# Altium schematic sheet my-cnc.SchDoc
size B
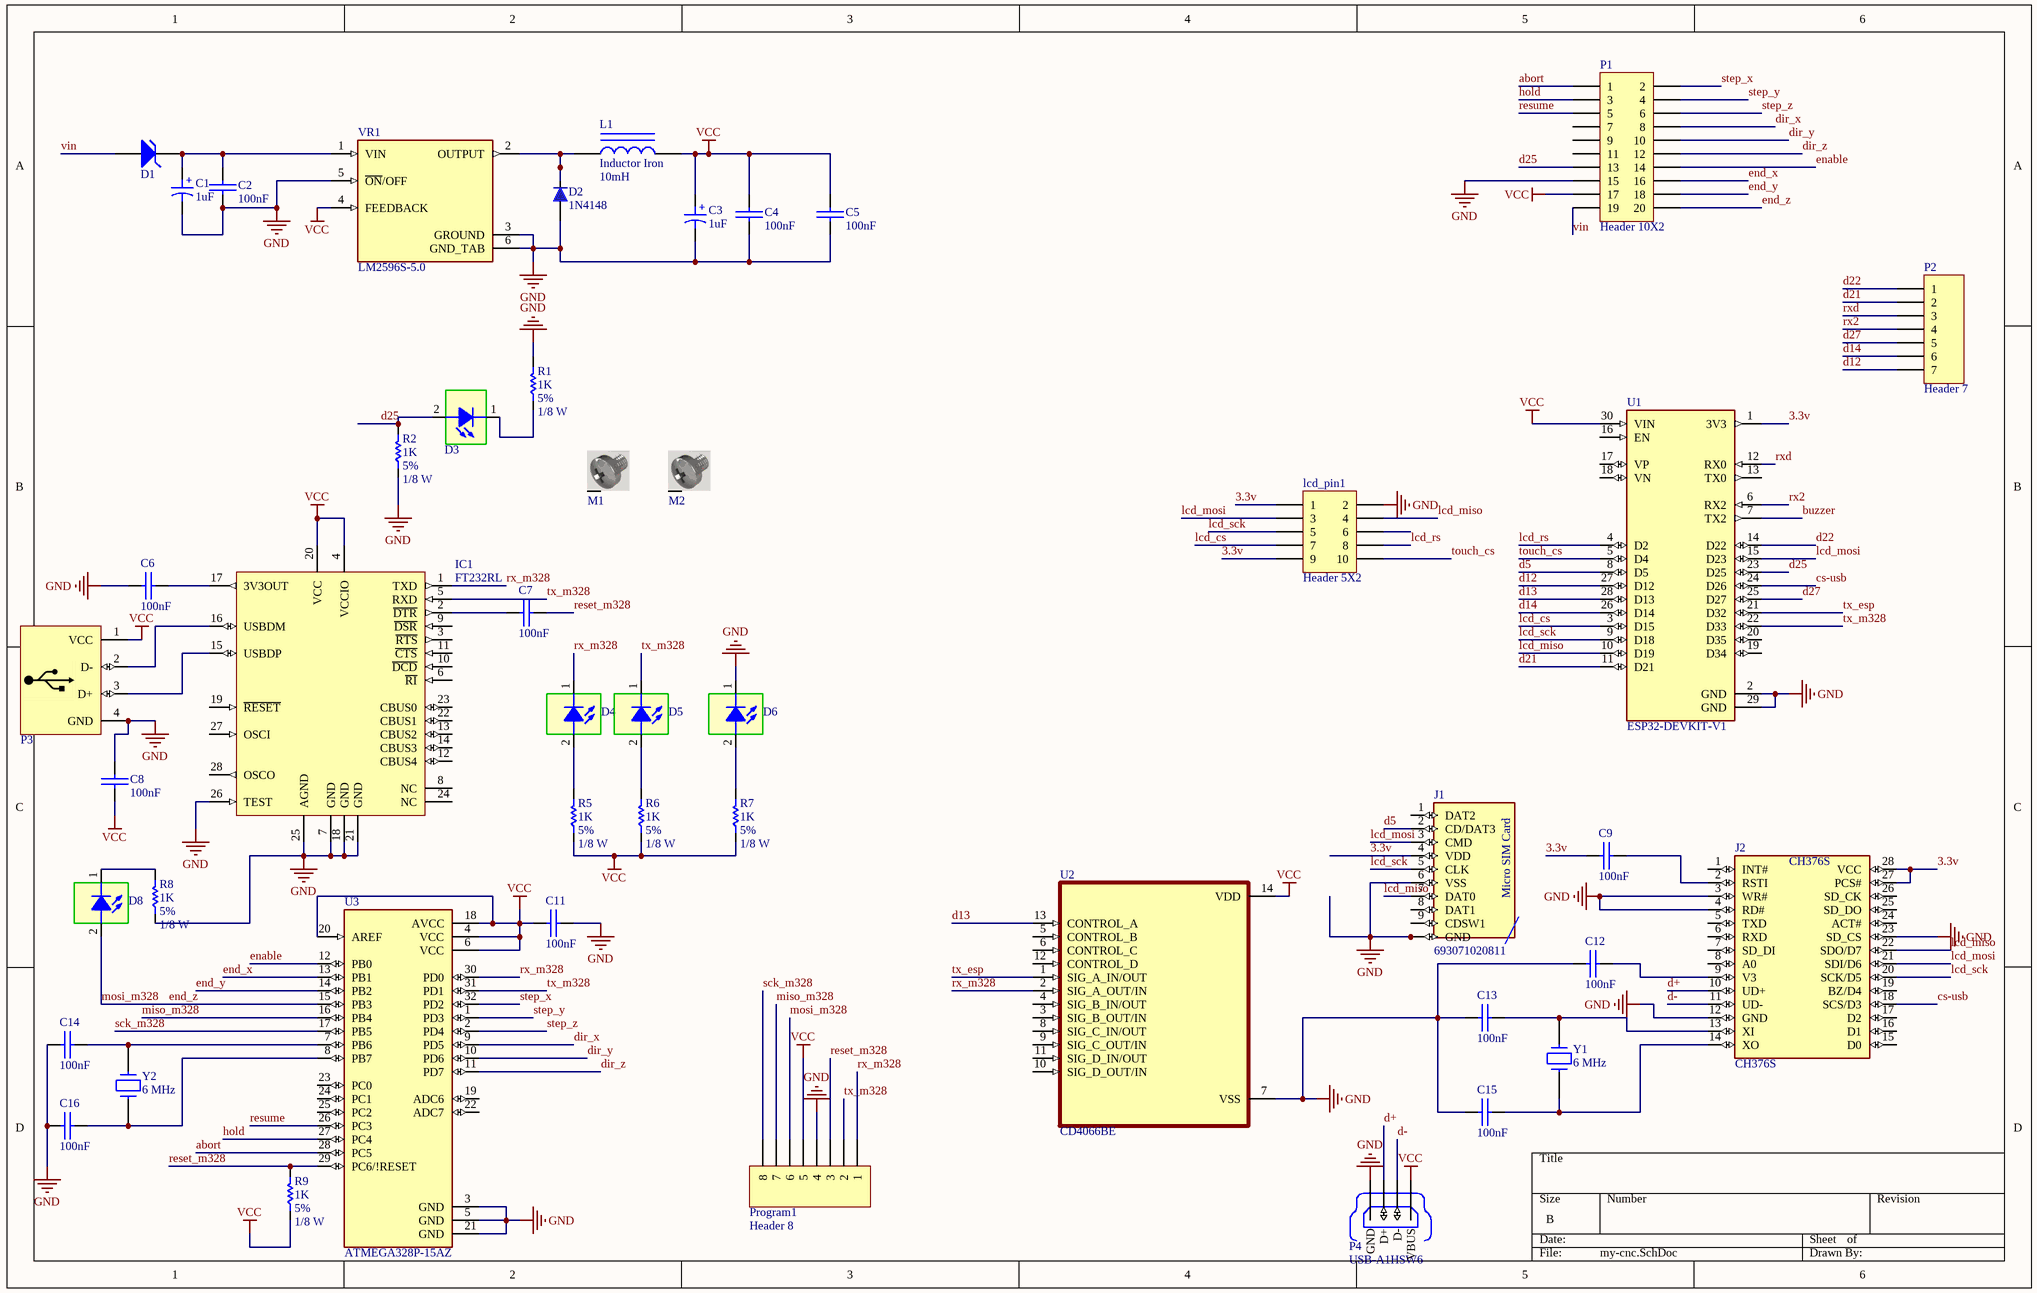
[diagram p0: my-cnc.SchDoc]

## Parts
C1  1uF  [CAP SMD 470uF]
C2  100nF  [SMD_CAP_1206]
C3  1uF  [CAP SMD 470uF]
C4  100nF  [SMD_CAP_1206]
C5  100nF  [SMD_CAP_1206]
C6  100nF  [SMD_CAP_1206]
C7  100nF  [SMD_CAP_1206]
C8  100nF  [SMD_CAP_1206]
C9  100nF  [SMD_CAP_1206]
C11  100nF  [SMD_CAP_1206]
C12  100nF  [SMD_CAP_1206]
C13  100nF  [SMD_CAP_1206]
C14  100nF  [SMD_CAP_1206]
C15  100nF  [SMD_CAP_1206]
C16  100nF  [SMD_CAP_1206]
D1  Diode Zener  [Diode 1W]  (value not drawn)
D2  1N4148  [Diode 1n4148 SMD]
D3  SMD 1206 LED  [LED 1206]  (value not drawn)
D4  SMD 1206 LED  [LED 1206]  (value not drawn)
D5  SMD 1206 LED  [LED 1206]  (value not drawn)
D6  SMD 1206 LED  [LED 1206]  (value not drawn)
D8  SMD 1206 LED  [LED 1206]  (value not drawn)
IC1  FT232RL  [SSOP-28_L]
J1  693071020811  [693071020811]
J2  CH376S  [SOP28]
L1  Inductor Iron  value 10mH  [AXIAL-0.9]
lcd_pin1  Header 5X2  [HDR2X5]
M1  Screw  [Board Screw]  (value not drawn)
M2  Screw  [Board Screw]  (value not drawn)
P1  Header 10X2  [HDR2X10]
P2  Header 7  [HDR1X7]
P3  USB Connector  [USB2.5-2H4F]  (value not drawn)
P4  USB-A1HSW6  [OST_USB-A1HSW6]
Program1  Header 8  [HDR1X8]
R1  Tolerance: 5%  Power: 1/8 W  [RES 1206 (3216X08L)]  (hidden comment: 1K)
R2  Tolerance: 5%  Power: 1/8 W  [RES 1206 (3216X08L)]  (hidden comment: 1K)
R5  Tolerance: 5%  Power: 1/8 W  [RES 1206 (3216X08L)]  (hidden comment: 1K)
R6  Tolerance: 5%  Power: 1/8 W  [RES 1206 (3216X08L)]  (hidden comment: 1K)
R7  Tolerance: 5%  Power: 1/8 W  [RES 1206 (3216X08L)]  (hidden comment: 1K)
R8  Tolerance: 5%  Power: 1/8 W  [RES 1206 (3216X08L)]  (hidden comment: 1K)
R9  Tolerance: 5%  Power: 1/8 W  [RES 1206 (3216X08L)]  (hidden comment: 1K)
U1  ESP32-DEVKIT-V1  [MODULE_ESP32_DEVKIT_V1]
U2  CD4066BE  [DIP794W45P254L1969H508Q14]
U3  ATMEGA328P-15AZ  [QFP80P900X900X120-32N]
VR1  LM2596S-5.0  [TO170P1524X483-6N]
Y1  6 MHz  [My_Crystal]
Y2  6 MHz  [My_Crystal]

## Nets
GND: C1.2 C2.1(+) C3.2 C4.1(+) C5.1(+) C6.2(-) C8.1(+) C11.2(-) C12.2(-) C13.2(-) C14.1(+) C15.2(-) C16.1(+) D2.1 D6.1 IC1.7(GND) IC1.18(GND) IC1.21(GND) IC1.25(AGND) IC1.26(TEST) J1.6(VSS) J1.10(GND) J1.11(GND) J1.12(GND) J1.13(GND) J2.3(WR#) J2.4(RD#) J2.12(GND) J2.23(SD_CS) lcd_pin1.2 P1.15 P3.4(GND) P4.4(GND) Program1.4 R1.2 R2.1 R8.1 U1.2(GND) U1.29(GND) U2.7(VSS) U3.3(GND) U3.5(GND) U3.21(GND) VR1.3(GROUND) VR1.5(~{ON}/OFF) VR1.6(GND_TAB)
VCC: C3.1 C4.2(-) C5.2(-) C8.2(-) C11.1(+) IC1.4(VCCIO) IC1.20(VCC) L1.2 P1.17 P3.1(VCC) P4.1(VBUS) Program1.5 R5.1 R6.1 R7.1 R9.1 U1.30(VIN) U2.14(VDD) U3.4(VCC) U3.6(VCC) U3.18(AVCC) U3.20(AREF) VR1.4(FEEDBACK)
3.3v: C9.2(-) J1.4(VDD) J2.27(PCS#) J2.28(VCC) lcd_pin1.1 lcd_pin1.9 U1.1(3V3)
abort: P1.1 U3.28(PC5)
buzzer: U1.7(TX2)
cs-usb: J2.18(SCS/D3) U1.24(D26)
d5: J1.2(CD/DAT3) U1.8(D5)
d12: P2.7 U1.27(D12)
d13: U1.28(D13) U2.13(CONTROL_A)
d14: P2.6 U1.26(D14)
d21: P2.2 U1.11(D21)
d22: P2.1 U1.14(D22)
d25: D3.2 P1.13 R2.2 U1.23(D25)
d27: P2.5 U1.25(D27)
d+: J2.10(UD+) P4.3(D+)
d-: J2.11(UD-) P4.2(D-)
dir_x: P1.8 U3.9(PD5)
dir_y: P1.10 U3.10(PD6)
dir_z: P1.12 U3.11(PD7)
enable: P1.14 U3.12(PB0)
end_x: P1.16 U3.13(PB1)
end_y: P1.18 U3.14(PB2)
end_z: D8.2 P1.20 Program1.6 U3.15(PB3)  [also labelled mosi_m328]
hold: P1.3 U3.27(PC4)
lcd_cs: lcd_pin1.7 U1.3(D15)
lcd_miso: J1.7(DAT0) J2.22(SDO/D7) lcd_pin1.4 U1.10(D19)
lcd_mosi: J1.3(CMD) J2.21(SDI/D6) lcd_pin1.3 U1.15(D23)
lcd_rs: lcd_pin1.8 U1.4(D2)
lcd_sck: J1.5(CLK) J2.20(SCK/D5) lcd_pin1.5 U1.9(D18)
miso_m328: Program1.7 U3.16(PB4)
reset_m328: C7.1(+) Program1.3 R9.2 U3.29(PC6/!RESET)
resume: P1.5 U3.26(PC3)
rx2: P2.4 U1.6(RX2)
rx_m328: D4.1 IC1.1(TXD) Program1.1 U2.2(SIG_A_OUT/IN) U3.30(PD0)
rxd: P2.3 U1.12(RX0)
sck_m328: Program1.8 U3.17(PB5)
step_x: P1.2 U3.32(PD2)
step_y: P1.4 U3.1(PD3)
step_z: P1.6 U3.2(PD4)
touch_cs: lcd_pin1.10 U1.5(D4)
tx_esp: U1.21(D32) U2.1(SIG_A_IN/OUT)
tx_m328: D5.1 IC1.5(RXD) Program1.2 U1.22(D33) U3.31(PD1)
vin: D1.1(A) P1.19
NetC1_1: C1.1 C2.2(-) D1.2(K) VR1.1(VIN)
NetC6_1: C6.1(+) IC1.17(3V3OUT)
NetC7_2: C7.2(-) IC1.2(~{DTR})
NetC9_1: C9.1(+) J2.2(RSTI)
NetC12_1: C12.1(+) J2.9(V3)
NetC13_1: C13.1(+) J2.13(XI) Y1.2
NetC14_2: C14.2(-) U3.7(PB6) Y2.2
NetC15_1: C15.1(+) J2.14(XO) Y1.1
NetC16_2: C16.2(-) U3.8(PB7) Y2.1
NetD2_2: D2.2 L1.1 VR1.2(OUTPUT)
NetD3_1: D3.1 R1.1
NetD4_2: D4.2 R5.2
NetD5_2: D5.2 R6.2
NetD6_2: D6.2 R7.2
NetD8_1: D8.1 R8.2
NetIC1_15: IC1.15(USBDP) P3.3(D+)
NetIC1_16: IC1.16(USBDM) P3.2(D-)

Not connected (* = marked no-connect by the designer): IC1 3(~{RTS}) 6(~{RI}) 8(NC) 9(~{DSR}) 10(~{DCD}) 11(~{CTS}) 12(CBUS4) 13(CBUS2) 14(CBUS3) 19(~{RESET}) 22(CBUS1) 23(CBUS0) 24(NC) 27(OSCI) 28(OSCO); J1 1(DAT2) 8(DAT1) 9(CDSW1); J2 1(INT#) 5(TXD) 6(RXD) 7(SD_DI) 8(A0) 15(D0) 16(D1) 17(D2) 19(BZ/D4) 24(ACT#) 25(SD_DO) 26(SD_CK); lcd_pin1 6; M1 S; M2 S; P1 7 9 11; U1 13(TX0) 16(EN) 17(VP) 18(VN) 19(D34) 20(D35); U2 3(SIG_B_OUT/IN) 4(SIG_B_IN/OUT) 5(CONTROL_B) 6(CONTROL_C) 8(SIG_C_IN/OUT) 9(SIG_C_OUT/IN) 10(SIG_D_OUT/IN) 11(SIG_D_IN/OUT) 12(CONTROL_D); U3 19(ADC6) 22(ADC7) 23(PC0) 24(PC1) 25(PC2)

## Notes on the sheet
- (in symbol 693071020811) Micro SIM Card
- (in symbol Cap ELECTROLITIC TOTAL SIZE) +

## Library data of the parts
C1 C3 = Cap ELECTROLITIC TOTAL SIZE: Cap electrolitic radial; Designer: Abbas Basereh; Data: 16-12-2016; Part. No: *; VALUE: 1uF
C2 C4-C9 C11-C16 = Cap-Bipolar: Bipolar Capacitor; Voltage: 100V; Designer: Saeid Jorablo; Organazation: ControTec; Adding Date: 1387/12/20; Value: 100nF
D1 = Diode Zener: Zener Diode; Designer: Saeid Jorablo; Company: E.P.I.L; Voltage: 3.3 V; Design Date: 2011/11/02
D2 = 1N4148 SMD: General Semicoductor
D3-D6 D8 = LED SMD 1206
IC1 = FT232RL: USB UART Asynchronous Serial Data Transfer Chip, SSOP-28, Tape and Reel; Published: 19-Aug-2010; DatasheetVersion: ver 2.07, Jul-2010; PackageVersion: 2010; PackageReference: SSOP-28; Publisher: Altium Limited; PackageDescription: 28-Pin Small Outline Package 0.65 mm Pitch; ComponentLink1Description: Manufacturer Link; ComponentLink1URL: http://www.ftdichip.com/Products/ICs/FT232R.htm; ComponentLink2Description: Datasheet; ComponentLink2URL: http://www.ftdichip.com/Support/Documents/DataSheets/ICs/DS_FT232R.pdf
J1 = 693071020811: 9 (8 + 1) Position Card Connector Secure Digital - microSDâ„¢ Surface Mount, Right Angle Gold; MF: Wurth Electronics; SnapEDA_Link: https://www.snapeda.com/parts/693071020811/Wurth+Electronics/view-part/?ref=snap; Package: None; Value: *; MP: 693071020811; Check_prices: https://www.snapeda.com/parts/693071020811/Wurth+Electronics/view-part/?ref=eda
J2 = CH376S: File manage control chip. Small outline package of 28-pin; MF: WCH; SnapEDA_Link: https://www.snapeda.com/parts/CH376S/WCH/view-part/?ref=snap; MP: CH376S; Check_prices: https://www.snapeda.com/parts/CH376S/WCH/view-part/?ref=eda; Price: None; Value: *; Availability: Not in stock; Package: Package
L1 = Inductor Iron: Magnetic-Core Inductor; Published: 24-Mar-1999; LatestRevisionDate: 17-Jul-2002; LatestRevisionNote: Re-released for DXP Platform.; PackageReference: AXIAL-0.9; Publisher: Altium Limited; PackageDescription: Axial Device, Thru-Hole; 2 Leads; 0.9 in Pin Spacing
lcd_pin1 = Header 5X2: Header, 5-Pin, Dual row; LatestRevisionDate: 17-Jul-2002; LatestRevisionNote: Re-released for DXP Platform.; Publisher: Altium Limited
M1 M2 = Board Screw: Board Screw With Spacer
P1 = Header 10X2: Header, 10-Pin, Dual row; LatestRevisionDate: 17-Jul-2002; LatestRevisionNote: Re-released for DXP Platform.; Publisher: Altium Limited
P2 = Header 7: Header, 7-Pin; LatestRevisionDate: 17-Jul-2002; LatestRevisionNote: Re-released for DXP Platform.; Publisher: Altium Limited
P3 = USB B-Type: USB Connector-B Type; Adding Date: 10/26/2010
P4 = USB-A1HSW6: USB-A (USB TYPE-A) - Receptacle Connector 4 Position Through Hole, Right Angle; MF: On Shore; Value: *; SnapEDA_Link: https://www.snapeda.com/parts/USB-A1HSW6/On+Shore+Technology+Inc./view-part/?ref=snap; Purchase-URL: https://pricing.snapeda.com/search/part/USB-A1HSW6/?ref=eda; Availability: In Stock; Price: None; Package: None; Check_prices: https://www.snapeda.com/parts/USB-A1HSW6/On+Shore+Technology+Inc./view-part/?ref=eda; MP: USB-A1HSW6
Program1 = Header 8: Header, 8-Pin; LatestRevisionDate: 17-Jul-2002; LatestRevisionNote: Re-released for DXP Platform.; Publisher: Altium Limited
R1 R2 R5-R9 = Resistor: Value: 1K
U1 = ESP32-DEVKIT-V1: Dual core, Wi-Fi: 2.4 GHz up to 150 Mbits/s,BLE (Bluetooth Low Energy) and legacy Bluetooth, 32 bits, Up to 240 MHz; MF: Do it; Price: None; Availability: Not in stock; Package: None; MP: ESP32-DEVKIT-V1; Value: *; SnapEDA_Link: https://www.snapeda.com/parts/ESP32-DEVKIT-V1/Do+it/view-part/?ref=snap; Check_prices: https://www.snapeda.com/parts/ESP32-DEVKIT-V1/Do+it/view-part/?ref=eda
U2 = CD4066BE: 10-pA on-state leakage current, 20-V, 1:1 (SPST), 4-channel analog switch; MF: Texas Instruments; Value: *; SnapEDA_Link: https://www.snapeda.com/parts/CD4066BE/Texas+Instruments/view-part/?ref=snap; MP: CD4066BE; Purchase-URL: https://pricing.snapeda.com/search/part/CD4066BE/?ref=eda; Check_prices: https://www.snapeda.com/parts/CD4066BE/Texas+Instruments/view-part/?ref=eda; Availability: In Stock; Price: None; Package: PDIP-14 Texas Instruments
U3 = ATMEGA328P-15AZ: AVR Automotive, AEC-Q100, AVRÂ® ATmega Microcontroller IC 8-Bit 16MHz 32KB _16K x 16_ FLASH 32-TQFP _7x7_; MF: Microchip; SnapEDA_Link: https://www.snapeda.com/parts/ATMEGA328P-15AZ/Microchip/view-part/1227234/?ref=snap; Value: *; Digi-Key_Part_Number: ATMEGA328P-15AZCT-ND; Digi-Key_Purchase_URL: https://www.digikey.com/product-detail/en/microchip-technology/ATMEGA328P-15AZ/ATMEGA328P-15AZCT-ND/2477177?utm_source=snapeda&utm_medium=aggregator&utm_campaign=symbol; MP: ATMEGA328P-15AZ; Package: TQFP-32 Microchip
Y1 Y2 = CRYSTAL
VR1 = LM2596S-5.0: Value: *; MP: LM2596S-5.0; Package: None; Availability: Unavailable; Price: None